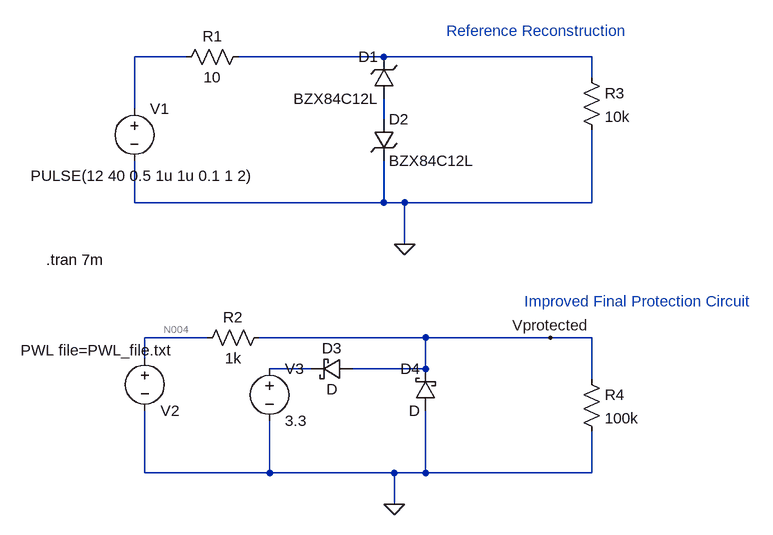
[diagram p0: schematic MCU_ADC_Protection.asc]
MCU_ADC_Protection.asc, the LTspice schematic file:
Version 4.1
SHEET 1 1052 680
WIRE 144 -32 64 -32
WIRE 448 -32 224 -32
WIRE 768 -32 448 -32
WIRE 768 0 768 -32
WIRE 64 48 64 -32
WIRE 448 64 448 32
WIRE 64 192 64 128
WIRE 448 192 448 128
WIRE 448 192 64 192
WIRE 480 192 448 192
WIRE 768 192 768 80
WIRE 768 192 480 192
WIRE 480 256 480 192
WIRE 176 400 80 400
WIRE 512 400 256 400
WIRE 704 400 512 400
WIRE 768 400 704 400
WIRE 80 432 80 400
WIRE 336 448 272 448
WIRE 512 448 512 400
WIRE 512 448 400 448
WIRE 768 464 768 400
WIRE 80 608 80 512
WIRE 272 608 272 528
WIRE 272 608 80 608
WIRE 464 608 272 608
WIRE 512 608 512 512
WIRE 512 608 464 608
WIRE 768 608 768 544
WIRE 768 608 512 608
WIRE 464 656 464 608
FLAG 704 400 Vprotected
FLAG 480 256 0
FLAG 464 656 0
SYMBOL voltage 64 32 R0
WINDOW 3 -160 119 Left 2
WINDOW 123 0 0 Left 0
WINDOW 39 0 0 Left 0
SYMATTR Value PULSE(12 40 0.5 1u 1u 0.1 1 2)
SYMATTR InstName V1
SYMBOL res 240 -48 R90
WINDOW 0 0 56 VBottom 2
WINDOW 3 32 56 VTop 2
SYMATTR InstName R1
SYMATTR Value 10
SYMBOL res 272 384 R90
WINDOW 0 0 56 VBottom 2
WINDOW 3 32 56 VTop 2
SYMATTR InstName R2
SYMATTR Value 1k
SYMBOL res 752 -16 R0
SYMATTR InstName R3
SYMATTR Value 10k
SYMBOL res 752 448 R0
SYMATTR InstName R4
SYMATTR Value 100k
SYMBOL zener 464 32 R180
WINDOW 0 24 64 Left 2
WINDOW 3 24 0 Left 2
SYMATTR InstName D1
SYMATTR Value BZX84C12L
SYMBOL zener 432 64 R0
SYMATTR InstName D2
SYMATTR Value BZX84C12L
SYMBOL voltage 80 416 R0
WINDOW 0 24 96 Left 2
WINDOW 3 -191 3 Left 2
WINDOW 123 0 0 Left 0
WINDOW 39 0 0 Left 0
SYMATTR InstName V2
SYMATTR Value PWL file=PWL_file.txt
SYMBOL schottky 400 432 R90
WINDOW 0 0 32 VBottom 2
WINDOW 3 32 32 VTop 2
SYMATTR InstName D3
SYMBOL schottky 528 512 R180
WINDOW 0 24 64 Left 2
WINDOW 3 24 0 Left 2
SYMATTR InstName D4
SYMBOL voltage 272 432 R0
WINDOW 123 0 0 Left 0
WINDOW 39 0 0 Left 0
SYMATTR InstName V3
SYMATTR Value 3.3
TEXT -72 280 Left 2 !.tran 7m
TEXT 544 -72 Left 2 ;Reference Reconstruction
TEXT 664 344 Left 2 ;Improved Final Protection Circuit

The netlist it stands for:
* MCU_ADC_Protection.asc
V1 N001 0 PULSE(12 40 0.5 1u 1u 0.1 1 2)
R1 N002 N001 10
R2 Vprotected N004 1k
R3 N002 0 10k
R4 Vprotected 0 100k
D1 N003 N002 BZX84C12L
D2 N003 0 BZX84C12L
V2 N004 0 PWL file=PWL_file.txt
D3 Vprotected N005 D
D4 0 Vprotected D
V3 N005 0 3.3
.model D D
.lib standard.dio
.tran 7m
* Reference Reconstruction
* Improved Final Protection Circuit
.backanno
.end

* Results of the author's LTspice run, read from the files saved beside the schematic
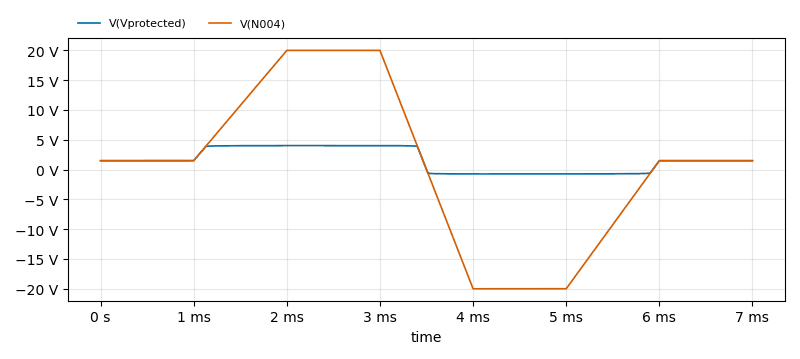
[diagram p1: Transient Analysis of MCU_ADC_Protection.asc, plotted from the saved traces]
* Transient Analysis, 1 run:
*   V(Vprotected): min -731.6 mV, max 4.027 V, average 1.565 V, rms 2.5 V, last 1.485 V
*   V(N004): min -20 V, max 20 V, average 642.9 mV, rms 13.13 V, last 1.5 V